# EAGLE schematic Sonar-Three-Amp-Block (EAGLE 8.7.1)
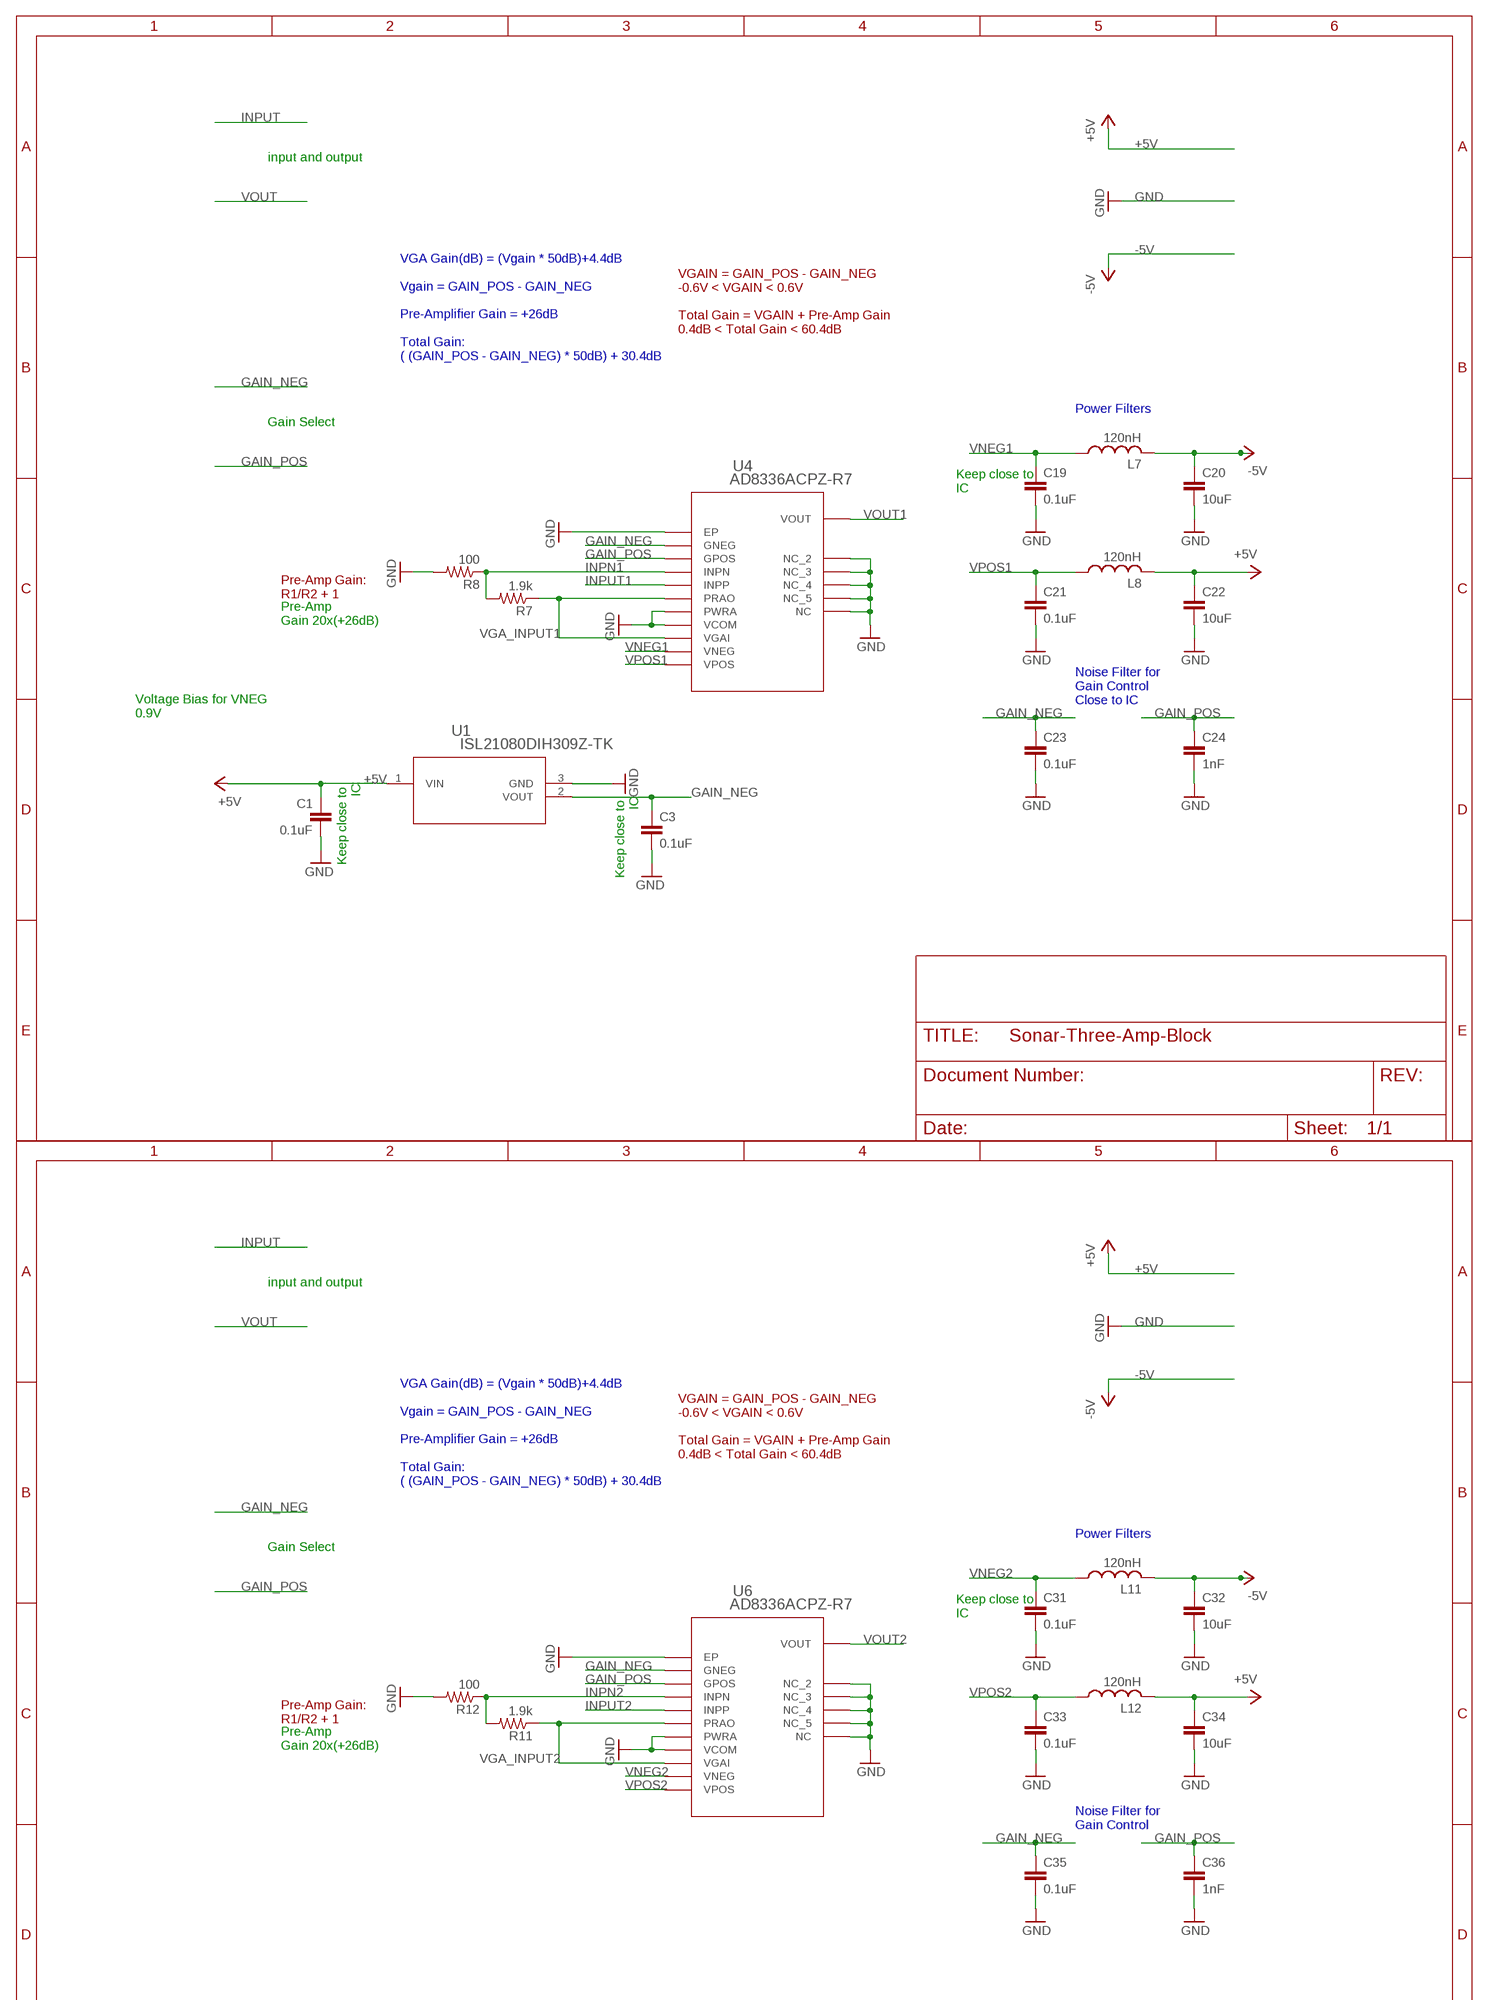
[diagram p0: schematic, sheet 1, part 1 of 2]
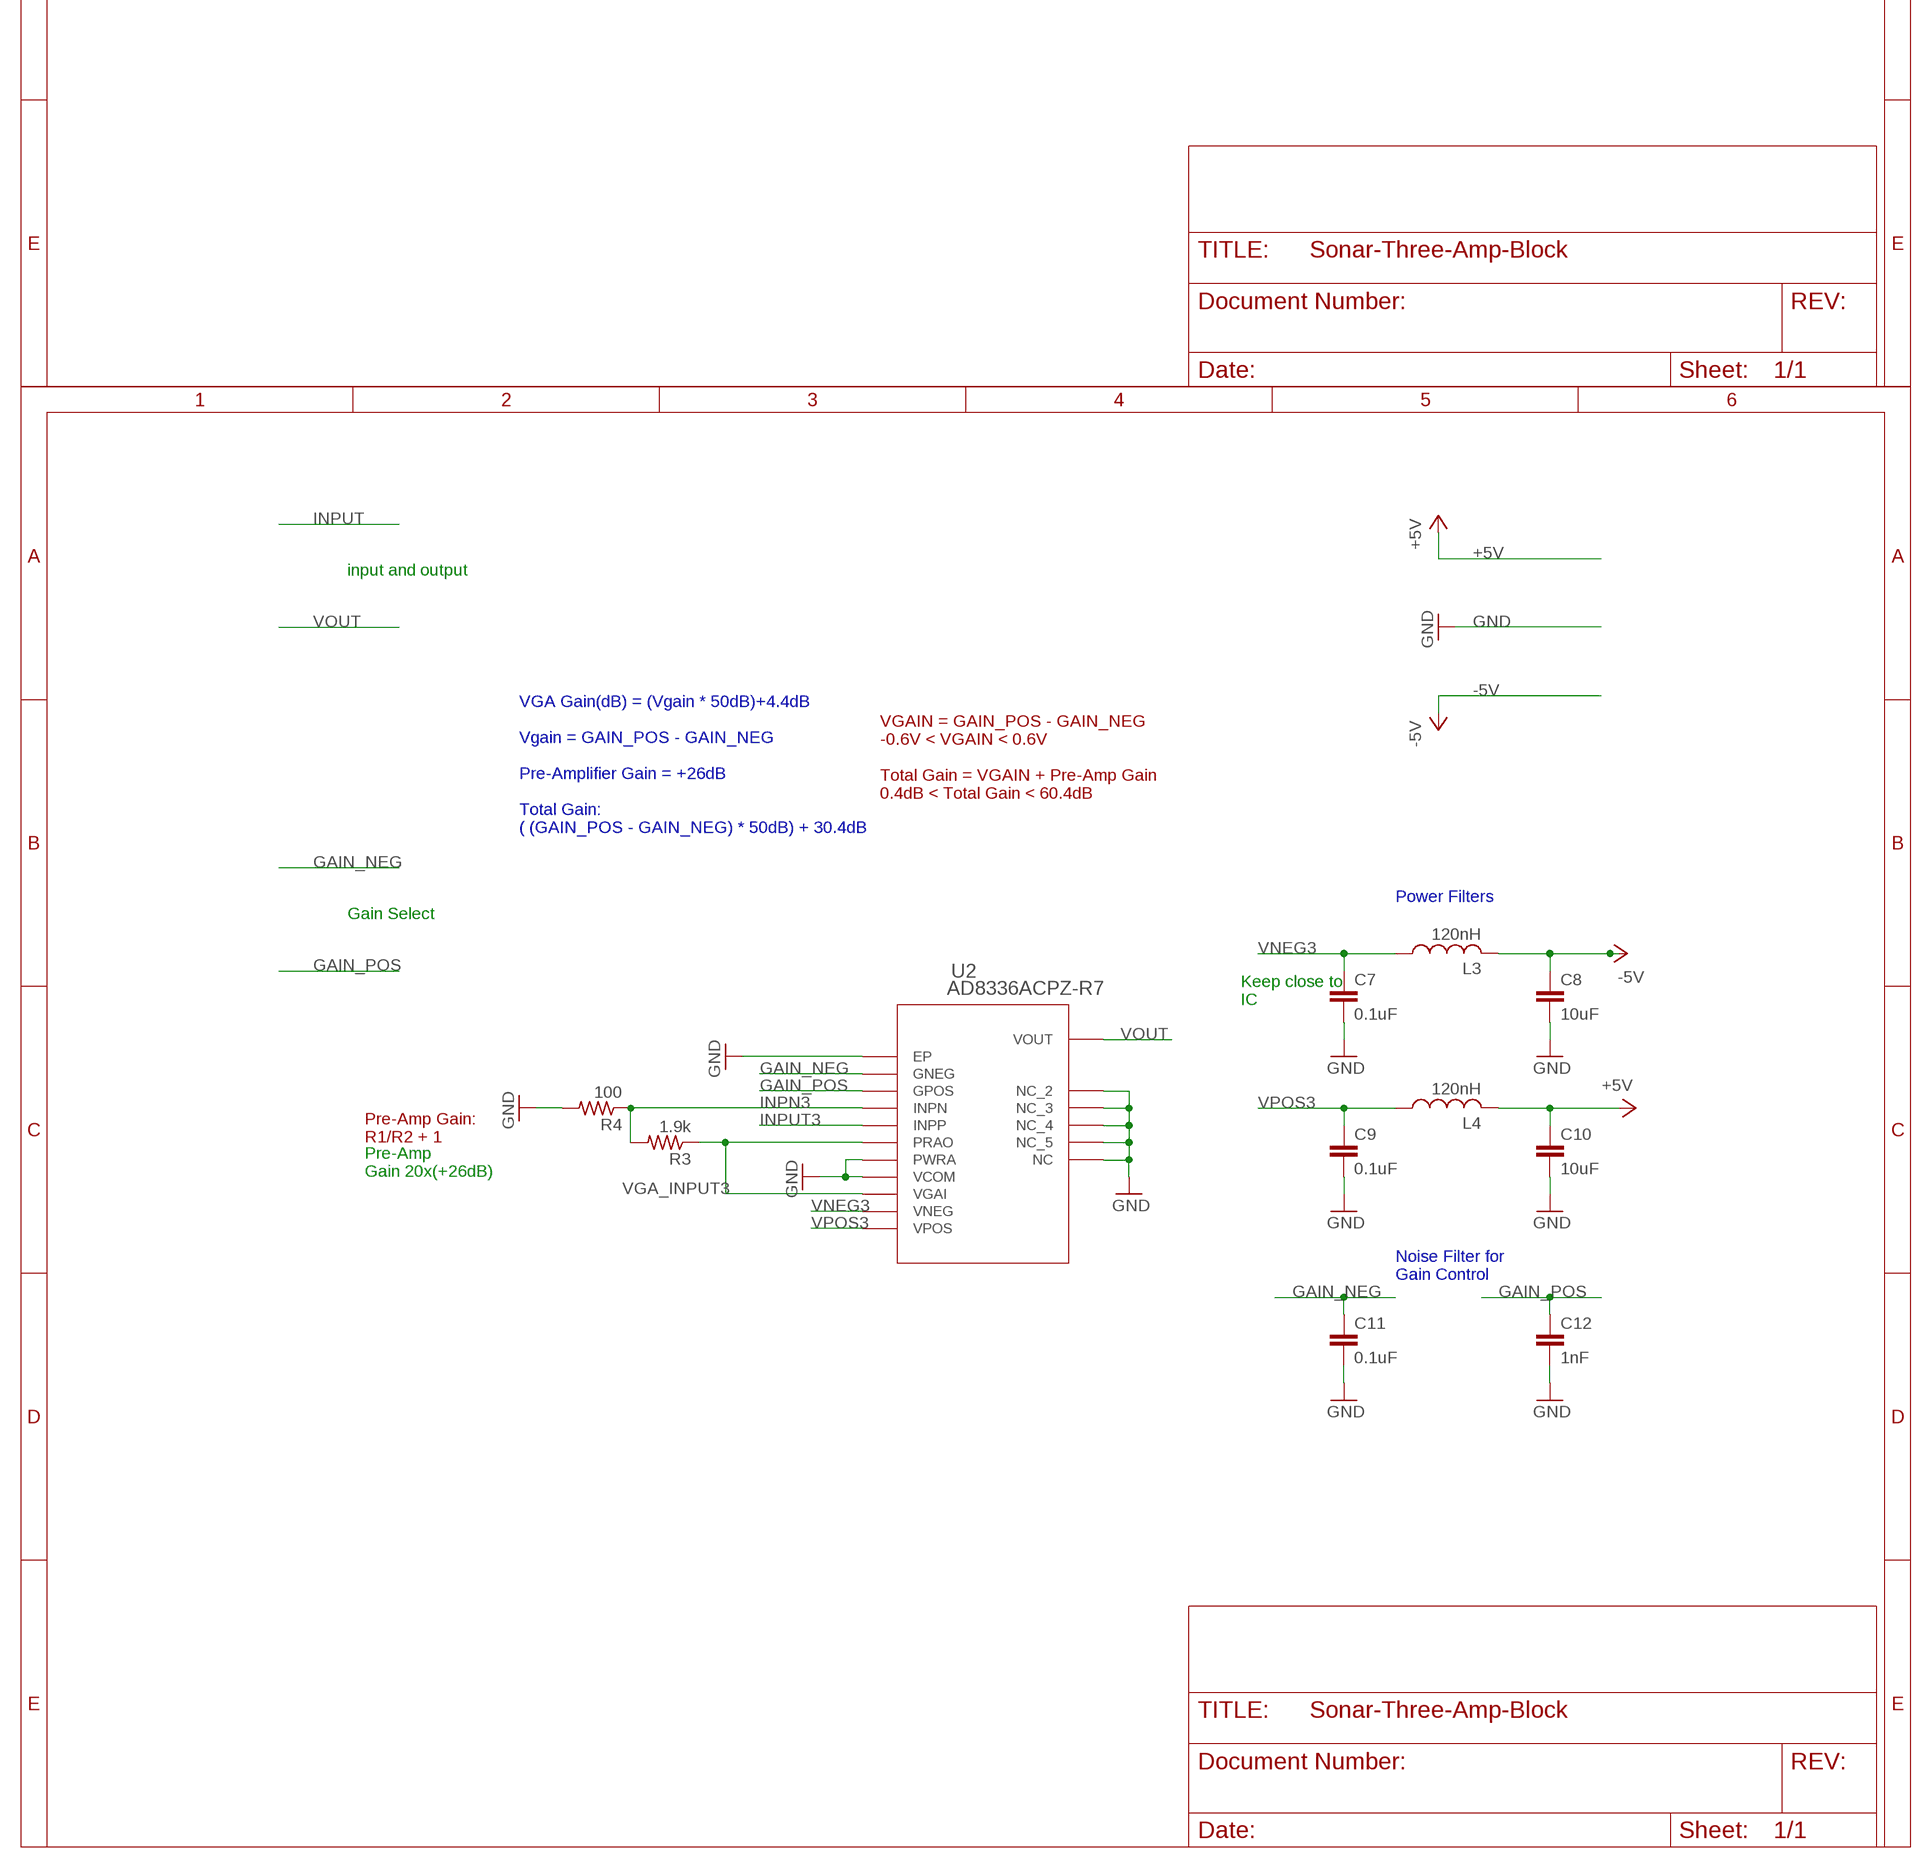
[diagram p1: schematic, sheet 1, part 2 of 2]

## Parts
C1  0.1uF  C-EUC0603  [C0603]
C3  0.1uF  C-EUC0603  [C0603]
C7  0.1uF  C-EUC0603  [C0603]
C8  10uF  C-EUC1206  [C1206]
C9  0.1uF  C-EUC0603  [C0603]
C10  10uF  C-EUC1206  [C1206]
C11  0.1uF  C-EUC0603  [C0603]
C12  1nF  C-EUC0603  [C0603]
C19  0.1uF  C-EUC0603  [C0603]
C20  10uF  C-EUC1206  [C1206]
C21  0.1uF  C-EUC0603  [C0603]
C22  10uF  C-EUC1206  [C1206]
C23  0.1uF  C-EUC0603  [C0603]
C24  1nF  C-EUC0603  [C0603]
C31  0.1uF  C-EUC0603  [C0603]
C32  10uF  C-EUC1206  [C1206]
C33  0.1uF  C-EUC0603  [C0603]
C34  10uF  C-EUC1206  [C1206]
C35  0.1uF  C-EUC0603  [C0603]
C36  1nF  C-EUC0603  [C0603]
L3  120nH  L-USL3225P  [L3225P]
L4  120nH  L-USL3225P  [L3225P]
L7  120nH  L-USL3225P  [L3225P]
L8  120nH  L-USL3225P  [L3225P]
L11  120nH  L-USL3225P  [L3225P]
L12  120nH  L-USL3225P  [L3225P]
R3  1.9k  R-US_R0603  [R0603]
R4  100  R-US_R0603  [R0603]
R7  1.9k  R-US_R0603  [R0603]
R8  100  R-US_R0603  [R0603]
R11  1.9k  R-US_R0603  [R0603]
R12  100  R-US_R0603  [R0603]
U1  ISL21080DIH309Z-TK  [P3_064]
U2  AD8336ACPZ-R7  [CP_16_4]
U4  AD8336ACPZ-R7  [CP_16_4]
U6  AD8336ACPZ-R7  [CP_16_4]

## Nets
+5V: C1.1 C10.1 C22.1 C34.1 L4.2 L8.2 L12.2 U1.1(VIN)
-5V: C8.1 C20.1 C32.1 L3.2 L7.2 L11.2
GAIN_NEG: C3.1 C11.1 C23.1 C35.1 U1.2(VOUT) U2.GNEG U4.GNEG U6.GNEG
GAIN_POS: C12.1 C24.1 C36.1 U2.GPOS U4.GPOS U6.GPOS
GND: C1.2 C3.2 C7.2 C8.2 C9.2 C10.2 C11.2 C12.2 C19.2 C20.2 C21.2 C22.2 C23.2 C24.2 C31.2 C32.2 C33.2 C34.2 C35.2 C36.2 R4.2 R8.2 R12.2 U1.3(GND) U2.GND1(EP) U2.NC U2.NC1(NC_2) U2.NC2(NC_3) U2.NC3(NC_4) U2.NC4(NC_5) U2.PWRA U2.VCOM U4.GND1(EP) U4.NC U4.NC1(NC_2) U4.NC2(NC_3) U4.NC3(NC_4) U4.NC4(NC_5) U4.PWRA U4.VCOM U6.GND1(EP) U6.NC U6.NC1(NC_2) U6.NC2(NC_3) U6.NC3(NC_4) U6.NC4(NC_5) U6.PWRA U6.VCOM
INPN1: R7.2 R8.1 U4.INPN
INPN2: R11.2 R12.1 U6.INPN
INPN3: R3.2 R4.1 U2.INPN
INPUT1: U4.INPP
INPUT2: U6.INPP
INPUT3: U2.INPP
VGA_INPUT1: R7.1 U4.PRAO U4.VGAI
VGA_INPUT2: R11.1 U6.PRAO U6.VGAI
VGA_INPUT3: R3.1 U2.PRAO U2.VGAI
VNEG1: C19.1 L7.1 U4.VNEG
VNEG2: C31.1 L11.1 U6.VNEG
VNEG3: C7.1 L3.1 U2.VNEG
VOUT: U2.VOUT
VOUT1: U4.VOUT
VOUT2: U6.VOUT
VPOS1: C21.1 L8.1 U4.VPOS
VPOS2: C33.1 L12.1 U6.VPOS
VPOS3: C9.1 L4.1 U2.VPOS

## Notes on the sheet
- input and output
- VGAIN = GAIN_POS - GAIN_NEG
  -0.6V < VGAIN < 0.6V
  
  Total Gain = VGAIN + Pre-Amp Gain
  0.4dB < Total Gain < 60.4dB
- VGA Gain(dB) = (Vgain * 50dB)+4.4dB
  
  Vgain = GAIN_POS - GAIN_NEG
  
  Pre-Amplifier Gain = +26dB
  
  Total Gain:
  ( (GAIN_POS - GAIN_NEG) * 50dB) + 30.4dB
- Power Filters
- Gain Select
- Keep close to 
  IC
- Pre-Amp Gain:
  R1/R2 + 1
- Pre-Amp 
  Gain 20x(+26dB)
- Noise Filter for
  Gain Control
  Close to IC
- Voltage Bias for VNEG
  0.9V
- Keep close to 
  IC
- Keep close to 
  IC
- input and output
- VGAIN = GAIN_POS - GAIN_NEG
  -0.6V < VGAIN < 0.6V
  
  Total Gain = VGAIN + Pre-Amp Gain
  0.4dB < Total Gain < 60.4dB
- VGA Gain(dB) = (Vgain * 50dB)+4.4dB
  
  Vgain = GAIN_POS - GAIN_NEG
  
  Pre-Amplifier Gain = +26dB
  
  Total Gain:
  ( (GAIN_POS - GAIN_NEG) * 50dB) + 30.4dB
- Power Filters
- Gain Select
- Keep close to 
  IC
- Pre-Amp Gain:
  R1/R2 + 1
- Pre-Amp 
  Gain 20x(+26dB)
- Noise Filter for
  Gain Control
- input and output
- VGAIN = GAIN_POS - GAIN_NEG
  -0.6V < VGAIN < 0.6V
  
  Total Gain = VGAIN + Pre-Amp Gain
  0.4dB < Total Gain < 60.4dB
- VGA Gain(dB) = (Vgain * 50dB)+4.4dB
  
  Vgain = GAIN_POS - GAIN_NEG
  
  Pre-Amplifier Gain = +26dB
  
  Total Gain:
  ( (GAIN_POS - GAIN_NEG) * 50dB) + 30.4dB
- Power Filters
- Gain Select
- Keep close to 
  IC
- Pre-Amp Gain:
  R1/R2 + 1
- Pre-Amp 
  Gain 20x(+26dB)
- Noise Filter for
  Gain Control

## Library data of the parts
C1 C3 C7 C9 C11 C12 C19 C21 C23 C24 C31 C33 C35 C36 = rcl:C-EU: CAPACITOR, European symbol; SPICEPREFIX: C
C8 C10 C20 C22 C32 C34 = resistor:C-EU: CAPACITOR, European symbol
L3 L4 L7 L8 L11 L12 = resistor:L-US: INDUCTOR, American symbol
R3 R4 R7 R8 R11 R12 = rcl:R-US_: RESISTOR, American symbol; SPICEPREFIX: R
U1 = Amplifier-Sonar-Prototype-LBR:ISL21080DIH309Z-TK; MANUFACTURER_PART_NUMBER: ISL21080DIH309ZTK; VENDOR: Intersil
U2 U4 U6 = Amplifier-Sonar-LBR:AD8336ACPZ-R7; MANUFACTURER_PART_NUMBER: AD8336ACPZR7; VENDOR: Analog Devices Inc